# Altium schematic sheet Принципиальная схема.SchDoc: Плата модуля управления
size 420 x 297 mm; CompanyName: Университет ИТМО; SheetNumber: 1; SheetTotal: 1; PageSetup: Record=PageOptions|CenterHorizontal=True|CenterVertical=True|PrintScale=0.94|XCorrection=1.00|YCorrection=1.00|PrintKind=1|BorderSize=5000000|LeftOffset=0|BottomOffset=0|Orientation=1|PaperLength=1000|PaperWidth=1000|Scale=100|PaperSource=7|PrintQuality=-4|MediaType=1|DitherType=10|PaperKind=A4|PrintScaleMode=1; DecimalNumber: СНАБ.468332.036; MainDevice: СНАБ.468332.036; Name2: Плата модуля управления; DocumentName: Sheet1.SCHDOC
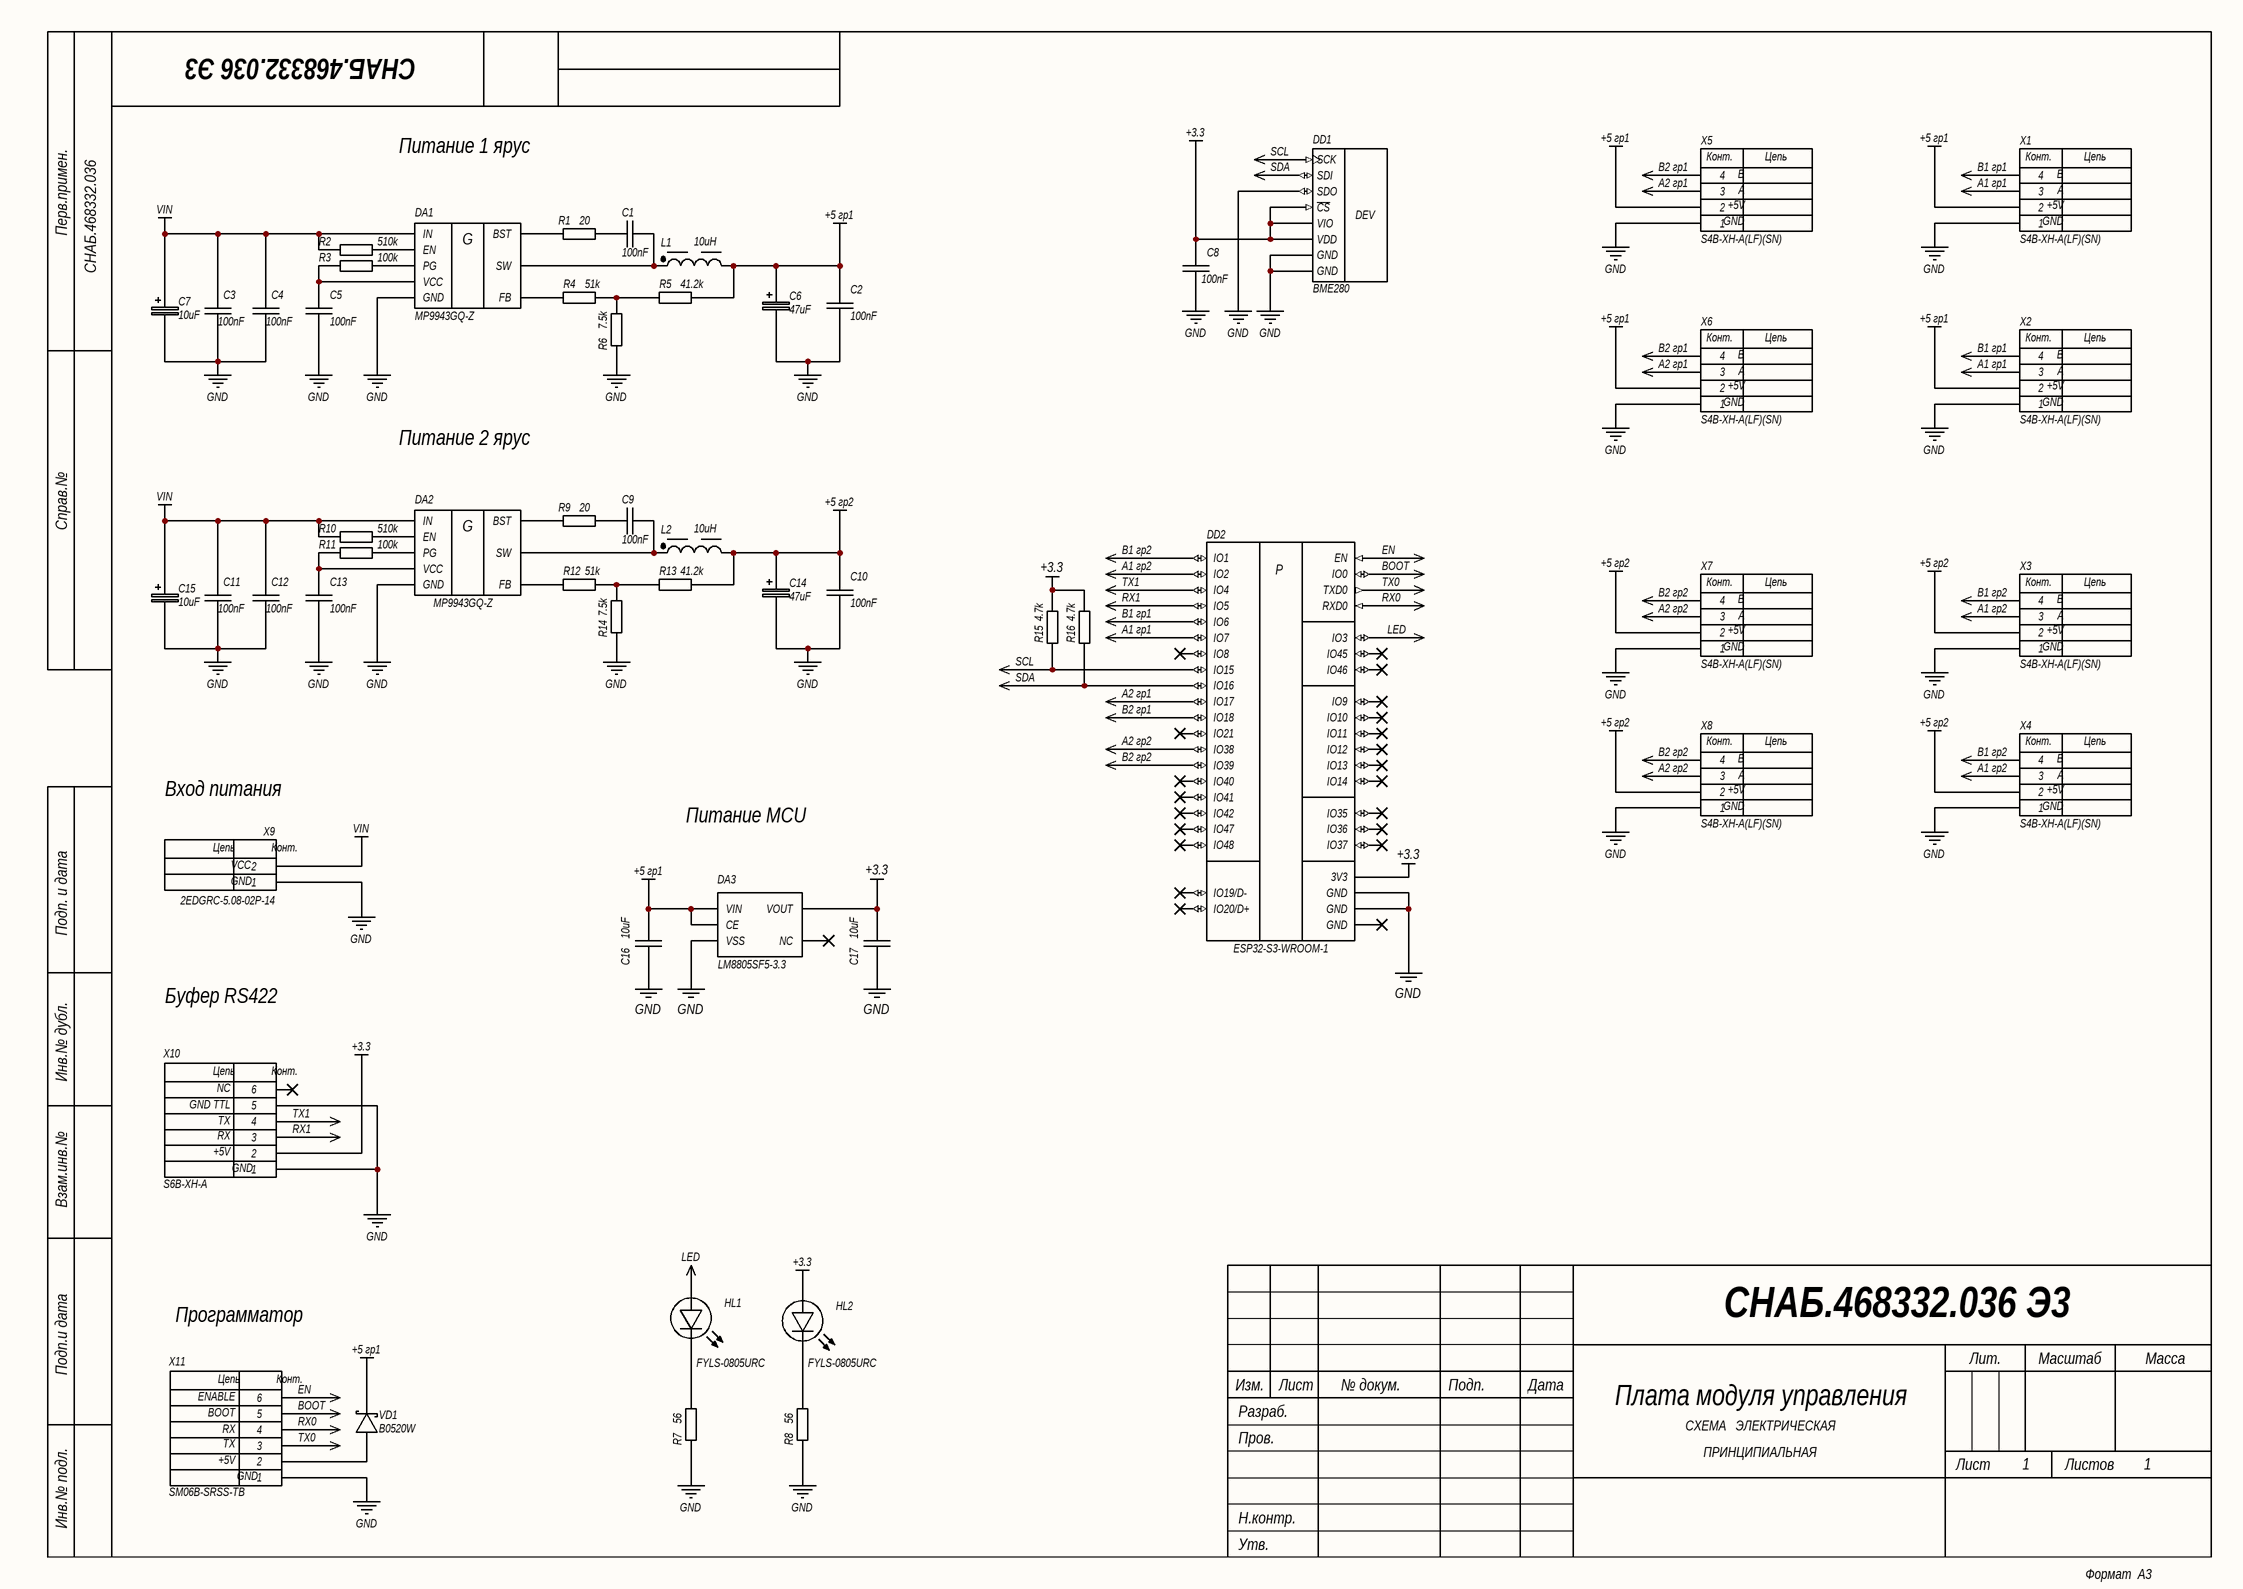
[diagram p0: Принципиальная схема.SchDoc]

## Parts
C1  100nF  [CAPC2012X10N]
C2  100nF  [CAPC2012X10N]
C3  100nF  [CAPC2012X10N]
C4  100nF  [CAPC2012X10N]
C5  100nF  [CAPC2012X10N]
C6  47uF  [FP-TAJA-MFG]
C7  10uF  [FP-TAJB-MFG]
C8  100nF  [CAPC2012X10N]
C9  100nF  [CAPC2012X10N]
C10  100nF  [CAPC2012X10N]
C11  100nF  [CAPC2012X10N]
C12  100nF  [CAPC2012X10N]
C13  100nF  [CAPC2012X10N]
C14  47uF  [FP-TAJA-MFG]
C15  10uF  [FP-TAJB-MFG]
C16  10uF  [CAPC2012X10N]
C17  10uF  [CAPC2012X10N]
DA1  MP9943GQ-Z  [MP9943 QFN8]
DA2  MP9943GQ-Z  [MP9943 QFN8]
DA3  LM8805SF5-3.3  [SOT95P280X130-5N]
DD1  BME280  [FP-BME280-MFG]
DD2  ESP32-S3-WROOM-1  [ESP32-S3-WROOM-1]
HL1  FYLS-0805URC  [LED 0805]
HL2  FYLS-0805URC  [LED 0805]
L1  10uH  [FP-IHLP-2525CZ-FP_2_413x3-MFG]
L2  10uH  [FP-IHLP-2525CZ-FP_2_413x3-MFG]
R1  20  [RES0805]
R2  510k  [RES0805]
R3  100k  [RES0805]
R4  51k  [RES0805]
R5  41.2k  [RES0805]
R6  7.5k  [RES0805]
R7  56  [RES0805]
R8  56  [RES0805]
R9  20  [RES0805]
R10  510k  [RES0805]
R11  100k  [RES0805]
R12  51k  [RES0805]
R13  41.2k  [RES0805]
R14  7.5k  [RES0805]
R15  4.7k  [RES0805]
R16  4.7k  [RES0805]
VD1  B0520W  [FP-SOD123-IPC_B]
X1  S4B-XH-A(LF)(SN)  [FP-S4B-XH-A-1_LF_SN-MFG]
X2  S4B-XH-A(LF)(SN)  [FP-S4B-XH-A-1_LF_SN-MFG]
X3  S4B-XH-A(LF)(SN)  [FP-S4B-XH-A-1_LF_SN-MFG]
X4  S4B-XH-A(LF)(SN)  [FP-S4B-XH-A-1_LF_SN-MFG]
X5  S4B-XH-A(LF)(SN)  [FP-S4B-XH-A-1_LF_SN-MFG]
X6  S4B-XH-A(LF)(SN)  [FP-S4B-XH-A-1_LF_SN-MFG]
X7  S4B-XH-A(LF)(SN)  [FP-S4B-XH-A-1_LF_SN-MFG]
X8  S4B-XH-A(LF)(SN)  [FP-S4B-XH-A-1_LF_SN-MFG]
X9  2EDGRC-5.08-02P-14  [691313510002]
X10  S6B-XH-A  [FP-S6B-XH-A_LF_SN-MFG]
X11  SM06B-SRSS-TB  [JST-SM06B-SRSS-TB_V]

## Nets
+3.3: C8.1(+) C17.1(+) DA3.5(VOUT) DD1.2(~{CS}) DD1.6(VIO) DD1.8(VDD) DD2.2(3V3) HL2.1 R15.2 R16.2 X10.2
+5 гр1: C2.1(+) C6.2(-) C16.1(+) DA3.1(VIN) DA3.3(CE) L1.2 R5.2 VD1.1 X1.2 X2.2 X5.2 X6.2
+5 гр2: C10.1(+) C14.2(-) L2.2 R13.2 X3.2 X4.2 X7.2 X8.2
GND: C2.2(-) C3.2(-) C4.2(-) C5.2(-) C6.1(+) C7.1(+) C8.2(-) C10.2(-) C11.2(-) C12.2(-) C13.2(-) C14.1(+) C15.1(+) C16.2(-) C17.2(-) DA1.5(GND) DA2.5(GND) DA3.2(VSS) DD1.1(GND) DD1.5(SDO) DD1.7(GND) DD2.1(GND) DD2.40(GND) R6.1 R7.1 R8.1 R14.1 X1.1 X2.1 X3.1 X4.1 X5.1 X6.1 X7.1 X8.1 X9.1 X10.1 X10.5 X11.1
VIN: C3.1(+) C4.1(+) C7.2(-) C11.1(+) C12.1(+) C15.2(-) DA1.7(IN) DA2.7(IN) R2.1 R10.1 X9.2
A1 гр1: DD2.7(IO7) X1.3 X2.3
A1 гр2: DD2.38(IO2) X3.3 X4.3
A2 гр1: DD2.10(IO17) X5.3 X6.3
A2 гр2: DD2.31(IO38) X7.3 X8.3
B1 гр1: DD2.6(IO6) X1.4 X2.4
B1 гр2: DD2.39(IO1) X3.4 X4.4
B2 гр1: DD2.11(IO18) X5.4 X6.4
B2 гр2: DD2.32(IO39) X7.4 X8.4
BOOT: DD2.27(IO0) X11.5
EN: DD2.3(EN) X11.6
LED: DD2.15(IO3) HL1.1
RX0: DD2.36(RXD0) X11.4
RX1: DD2.5(IO5) X10.3
SCL: DD1.4(SCK) DD2.8(IO15) R15.1
SDA: DD1.3(SDI) DD2.9(IO16) R16.1
TX0: DD2.37(TXD0) X11.3
TX1: DD2.4(IO4) X10.4
NetC1_1: C1.1(+) DA1.6(SW) L1.1
NetC1_2: C1.2(-) R1.2
NetC5_1: C5.1(+) DA1.2(VCC) R3.1
NetC9_1: C9.1(+) DA2.6(SW) L2.1
NetC9_2: C9.2(-) R9.2
NetC13_1: C13.1(+) DA2.2(VCC) R11.1
NetDA1_1: DA1.1(FB) R4.1
NetDA1_3: DA1.3(EN) R2.2
NetDA1_4: DA1.4(BST) R1.1
NetDA1_8: DA1.8(PG) R3.2
NetDA2_1: DA2.1(FB) R12.1
NetDA2_3: DA2.3(EN) R10.2
NetDA2_4: DA2.4(BST) R9.1
NetDA2_8: DA2.8(PG) R11.2
NetHL1_2: HL1.2 R7.2
NetHL2_2: HL2.2 R8.2
NetR4_2: R4.2 R5.1 R6.2
NetR12_2: R12.2 R13.1 R14.2
NetVD1_2: VD1.2 X11.2

Not connected (* = marked no-connect by the designer): DA3 4(NC)*; DD2 12(IO8)* 13(IO19/D-)* 14(IO20/D+)* 16(IO46)* 17(IO9)* 18(IO10)* 19(IO11)* 20(IO12)* 21(IO13)* 22(IO14)* 23(IO21)* 24(IO47)* 25(IO48)* 26(IO45)* 28(IO35)* 29(IO36)* 30(IO37)* 33(IO40)* 34(IO41)* 35(IO42)* 41(GND)*; X10 6*

## Notes on the sheet
- Питание 1 ярус
- Питание 2 ярус
- Вход питания
- Питание MCU
- Буфер RS422
- Программатор
- Перв.примен.
- Справ.№
- Подп. и дата
- Инв.№ дубл.
- Взам.инв.№
- Подп.и дата
- Разраб.
- Изм.
- Лист
- № докум.
- Подп.
- Дата
- Лит.
- Масштаб
- Масса
- Пров.
- СХЕМА   ЭЛЕКТРИЧЕСКАЯ
- ПРИНЦИПИАЛЬНАЯ
- Листов
- Инв.№ подл.
- Утв.
- Н.контр.
- Формат  A3
- (in symbol BME280) DEV
- (in symbol ESP32-S3-WROOM-1) P
- (in symbol JST-4P) Конт.; Цепь
- (in symbol JST-6P) Цепь; Конт.
- (in symbol MP9943GQ-Z) G
- (in symbol Screw terminal 2p) Цепь; Конт.; VCC

## Library data of the parts
C1-C5 C8 C9 C11-C13 = Конденсатор керамика
  C1-C5: ClassName: DCDC1
  C9 C11-C13: ClassName: DCDC2
C6 C7 C14 C15 = Конденсатор танталовый: Capacitor Polarised; Manufacturer_Name: Vishay; Manufacturer_Part_Number: 293D475X9010A2TE3; Datasheet Link: http://www.vishay.com/docs/40002/293d.pdf; Height: 1.8mm; Mouser Part Number: 74-293D475X9010A2TE3; Mouser Price/Stock: https://www.mouser.co.uk/ProductDetail/Vishay-Sprague/293D475X9010A2TE3?qs=zj6zwI%252Bv92RDYyeabgx%252B6w%3D%3D; Arrow Part Number: 293D475X9010A2TE3; Arrow Price/Stock: https://www.arrow.com/en/products/293d475x9010a2te3/vishay
  C6 C7: ClassName: DCDC1
  C14 C15: ClassName: DCDC2
C10 = Конденсатор керамика: Manufacturer: Murata; ClassName: DCDC2
C16 C17 = Capasitor SMD: ClassName: Power
DA1 DA2 = MP9943GQ-Z: High Efficiency 3A Peak, 36V, / Synchronous Step Down Converter / With Power Good
  DA1: ClassName: DCDC1
  DA2: ClassName: DCDC2
DA3 = XC6219B332MRN: Voltage stabilizer 3.3v 350mA; Manufacturer_Name: Torex; Datasheet Link: https://componentsearchengine.com/Datasheets/2/XC6219B332MRN.pdf; Height: 1.3mm; Manufacturer_Part_Number: XC6219B332MRN; ClassName: Power
DD1 = BME280: SENSOR PRESSURE HUMIDITY TEMP; Sensor Type: Temperature; Accuracy: 3%; Response Time: 1s; Output Type: SPI; Min Operating Temperature: -40°C; Max Operating Temperature: 85°C; Case/Package: LGA; Packaging: Cut Tape; Mount: Surface Mount; Lead Free: Lead Free; Number of Pins: 8
DD2 = ESP32-S3-WROOM-1: RX TXRX MOD WIFI SURFACE MOUNT; Frequency: 2.5GHz; Sensitivity: -98dBm; Operating Supply Voltage: 3.6V; Data Rate: 150Mbps; Weight: 0.088185oz; Package Quantity: 550; Min Operating Temperature: -40°C; Mount: Surface Mount; Max Operating Temperature: 85°C; Packaging: Cut Tape; Case/Package: SMD/SMT
HL1 = Светодиод: Manufacturer: Ningbo Foryard Optoelectronics; ClassName: Indacation
HL2 = Светодиод
L1 L2 = Дроссель: NexarPartId: 22866852; RMS Current (Irms): 420mA; Shielding: Shielded; Inductance: 150µH; Self Resonant Frequency: 7MHz; Saturation Current: 220mA; Core Material: Ferrite; Inductance Tolerance: 30%; DC Resistance (DCR): 770mΩ; Test Frequency: 100kHz; Max Operating Temperature: 125°C; Case/Package: 1919; Height - Seated (Max): 2.9972mm; Packaging: Tape & Reel (TR); Case Code (Imperial): 1919; Min Operating Temperature: -40°C; Current Rating: 420mA; Width: 4.8mm; Ambient Temperature Range High: 95°C; Ambient Temperature Range Low: -40°C; Mount: Surface Mount; Composition: Wirewound; Number of Pins: 2; REACH SVHC: Unknown; RoHS: Compliant; Case Code (Metric): 4848; Tolerance: 30%; Height: 2.8mm; Length: 4.8mm; Max DC Current: 420mA; Termination: SMD/SMT
  L1: ClassName: DCDC1
  L2: ClassName: DCDC2
R1-R16 = Резистор SMD: SMD resistors with differents footprints
  R1-R6: ClassName: DCDC1
  R7: ClassName: Indacation
  R9-R14: ClassName: DCDC2
VD1 = Диод Шоттки
X1-X8 = JST-4P: JST type connector; Net1: GND; Net2: +5V; Net3: A; Net4: B
X9 = Screw terminal 2p: XT30-PWM; Net1: GND; Net2: +5V
X10 = JST-6P: JST type connector; Net1: GND; Net2: +5V; Net3: RX; Net4: TX; Net5: GND TTL; Net6: NC
X11 = JST-6P: JST type connector; Net1: GND; Net2: +5V; Net3: TX; Net4: RX; Net5: BOOT; Net6: ENABLE